# Altium project PCB_Project1.PrjPcb
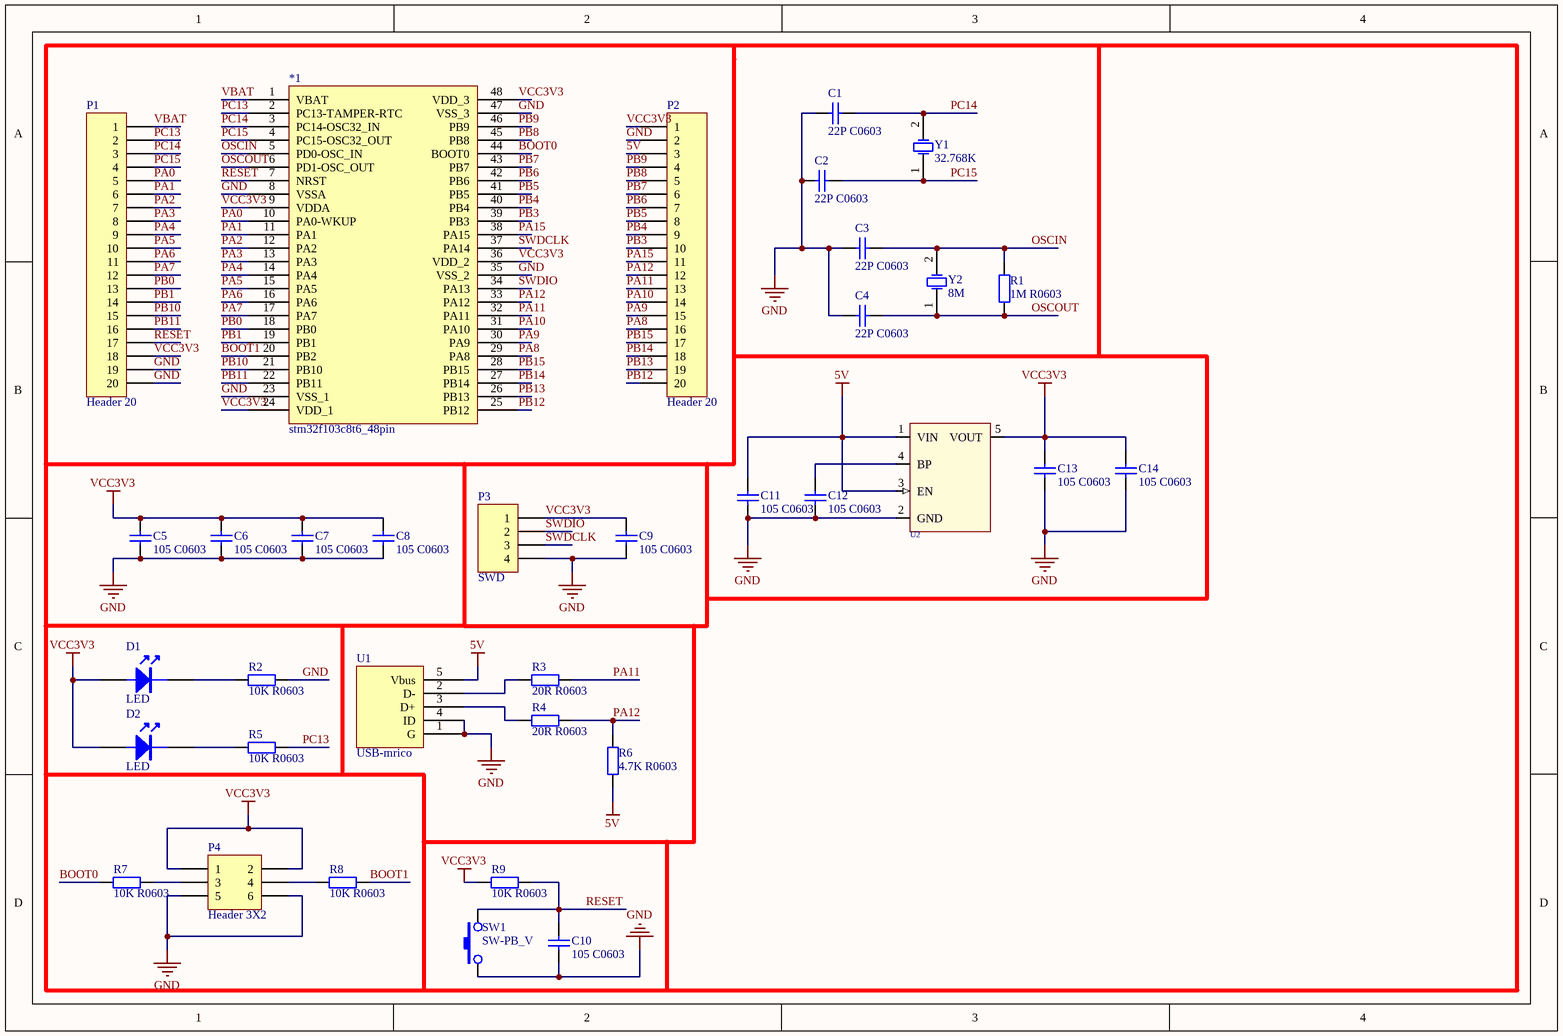
[diagram p0: Sheet1.SchDoc]
1 sheet, 35 parts. Net scope: global (net labels, ports and power ports of the same name join across sheets).
Board file: PCB1.PcbDoc

## Sheet Sheet1.SchDoc
size A4; SheetNumber: 1; SheetTotal: 1

### Parts
*1  stm32f103c8t6_48pin  [TQFP48 7x7_L]
C1  22P C0603  [C 0603]
C2  22P C0603  [C 0603]
C3  22P C0603  [C 0603]
C4  22P C0603  [C 0603]
C5  105 C0603  [C 0603]
C6  105 C0603  [C 0603]
C7  105 C0603  [C 0603]
C8  105 C0603  [C 0603]
C9  105 C0603  [C 0603]
C10  105 C0603  [C 0603]
C11  105 C0603  [C 0603]
C12  105 C0603  [C 0603]
C13  105 C0603  [C 0603]
C14  105 C0603  [C 0603]
D1  LED  [LED 0805G]
D2  LED  [LED 0805G]
P1  Header 20  [HDR1X20]
P2  Header 20  [HDR1X20]
P3  SWD  [HDR-1X4_H]
P4  Header 3X2  [HDR-3X2]
R1  1M R0603  [R 0603]
R2  10K R0603  [R 0603]
R3  20R R0603  [R 0603]
R4  20R R0603  [R 0603]
R5  10K R0603  [R 0603]
R6  4.7K R0603  [R 0603]
R7  10K R0603  [R 0603]
R8  10K R0603  [R 0603]
R9  10K R0603  [R 0603]
SW1  SW-PB_V  [TSW SMD-3*6*2.5]
U1  USB-mrico  [USB-micro_B]
U2  RT9193  [SOT23-5L]  (value not drawn)
Y1  32.768K  [XTAL-49S DIP]
Y2  8M  [XTAL-49S DIP]

### Nets
5V: C11.2 P2.3 R6.1 U1.5(Vbus) U2.1(VIN) U2.3(EN)
GND: *1.8(VSSA) *1.23(VSS_1) *1.35(VSS_2) *1.47(VSS_3) C1.1 C2.1 C3.1 C4.1 C5.1 C6.1 C7.1 C8.1 C9.1 C10.1 C11.1 C12.1 C13.1 C14.1 P1.19 P1.20 P2.2 P3.4 P4.5 P4.6 R2.2 SW1.2 U1.1(G) U1.4(ID) U2.2(GND)
VCC3V3: *1.9(VDDA) *1.24(VDD_1) *1.36(VDD_2) *1.48(VDD_3) C5.2 C6.2 C7.2 C8.2 C9.2 C13.2 C14.2 D1.1 D2.1 P1.18 P2.1 P3.1 P4.1 P4.2 R9.1 U2.5(VOUT)
BOOT0: *1.44(BOOT0) R7.1
BOOT1: *1.20(PB2) R8.2
OSCIN: *1.5(PD0-OSC_IN) C3.2 R1.2 Y2.2(OSC2)
OSCOUT: *1.6(PD1-OSC_OUT) C4.2 R1.1 Y2.1(OSC1)
PA0: *1.10(PA0-WKUP) P1.5
PA1: *1.11(PA1) P1.6
PA2: *1.12(PA2) P1.7
PA3: *1.13(PA3) P1.8
PA4: *1.14(PA4) P1.9
PA5: *1.15(PA5) P1.10
PA6: *1.16(PA6) P1.11
PA7: *1.17(PA7) P1.12
PA8: *1.29(PA8) P2.16
PA9: *1.30(PA9) P2.15
PA10: *1.31(PA10) P2.14
PA11: *1.32(PA11) P2.13 R3.2
PA12: *1.33(PA12) P2.12 R4.2 R6.2
PA15: *1.38(PA15) P2.11
PB0: *1.18(PB0) P1.13
PB1: *1.19(PB1) P1.14
PB3: *1.39(PB3) P2.10
PB4: *1.40(PB4) P2.9
PB5: *1.41(PB5) P2.8
PB6: *1.42(PB6) P2.7
PB7: *1.43(PB7) P2.6
PB8: *1.45(PB8) P2.5
PB9: *1.46(PB9) P2.4
PB10: *1.21(PB10) P1.15
PB11: *1.22(PB11) P1.16
PB12: *1.25(PB12) P2.20
PB13: *1.26(PB13) P2.19
PB14: *1.27(PB14) P2.18
PB15: *1.28(PB15) P2.17
PC13: *1.2(PC13-TAMPER-RTC) P1.2 R5.2
PC14: *1.3(PC14-OSC32_IN) C1.2 P1.3 Y1.2(OSC2)
PC15: *1.4(PC15-OSC32_OUT) C2.2 P1.4 Y1.1(OSC1)
RESET: *1.7(NRST) C10.2 P1.17 R9.2 SW1.1
SWDCLK: *1.37(PA14) P3.3
SWDIO: *1.34(PA13) P3.2
VBAT: *1.1(VBAT) P1.1
NetC12_2: C12.2 U2.4(BP)
NetD1_2: D1.2 R2.1
NetD2_2: D2.2 R5.1
NetP4_3: P4.3 R7.2
NetP4_4: P4.4 R8.1
NetR3_1: R3.1 U1.2(D-)
NetR4_1: R4.1 U1.3(D+)

### Library data of the parts
C1-C14 = Cap: Value: 104; Published: 8-Jun-2000; LatestRevisionDate: 17-Jul-2002; LatestRevisionNote: Re-released for DXP Platform.; Publisher: Altium Limited
P1 P2 = Header1* 20: LatestRevisionDate: 17-Jul-2002; LatestRevisionNote: Re-released for DXP Platform.; Publisher: Altium Limited
P3 = Header 1*4: LatestRevisionDate: 17-Jul-2002; LatestRevisionNote: Re-released for DXP Platform.; Publisher: Altium Limited
P4 = Header 2*3: LatestRevisionDate: 17-Jul-2002; LatestRevisionNote: Re-released for DXP Platform.; Publisher: Altium Limited
R1-R9 = Res2: Published: 8-Jun-2000; LatestRevisionDate: 17-Jul-2002; LatestRevisionNote: Re-released for DXP Platform.; Publisher: Altium Limited
U1 = usb-STM
U2 = RT9193X_5P: ICA_MFR_NAME: RICHTEK; ICA_PARTNUM: $$2191094$$RT9193-15CU5; Part Number: TMP-13
Y1 Y2 = XTAL: Published: 8-Jun-2000; LatestRevisionDate: 17-Jul-2002; LatestRevisionNote: Re-released for DXP Platform.; Publisher: Altium Limited